# Altium schematic sheet GPIO.SchDoc
size A3; SheetNumber: 10; SheetTotal: 10
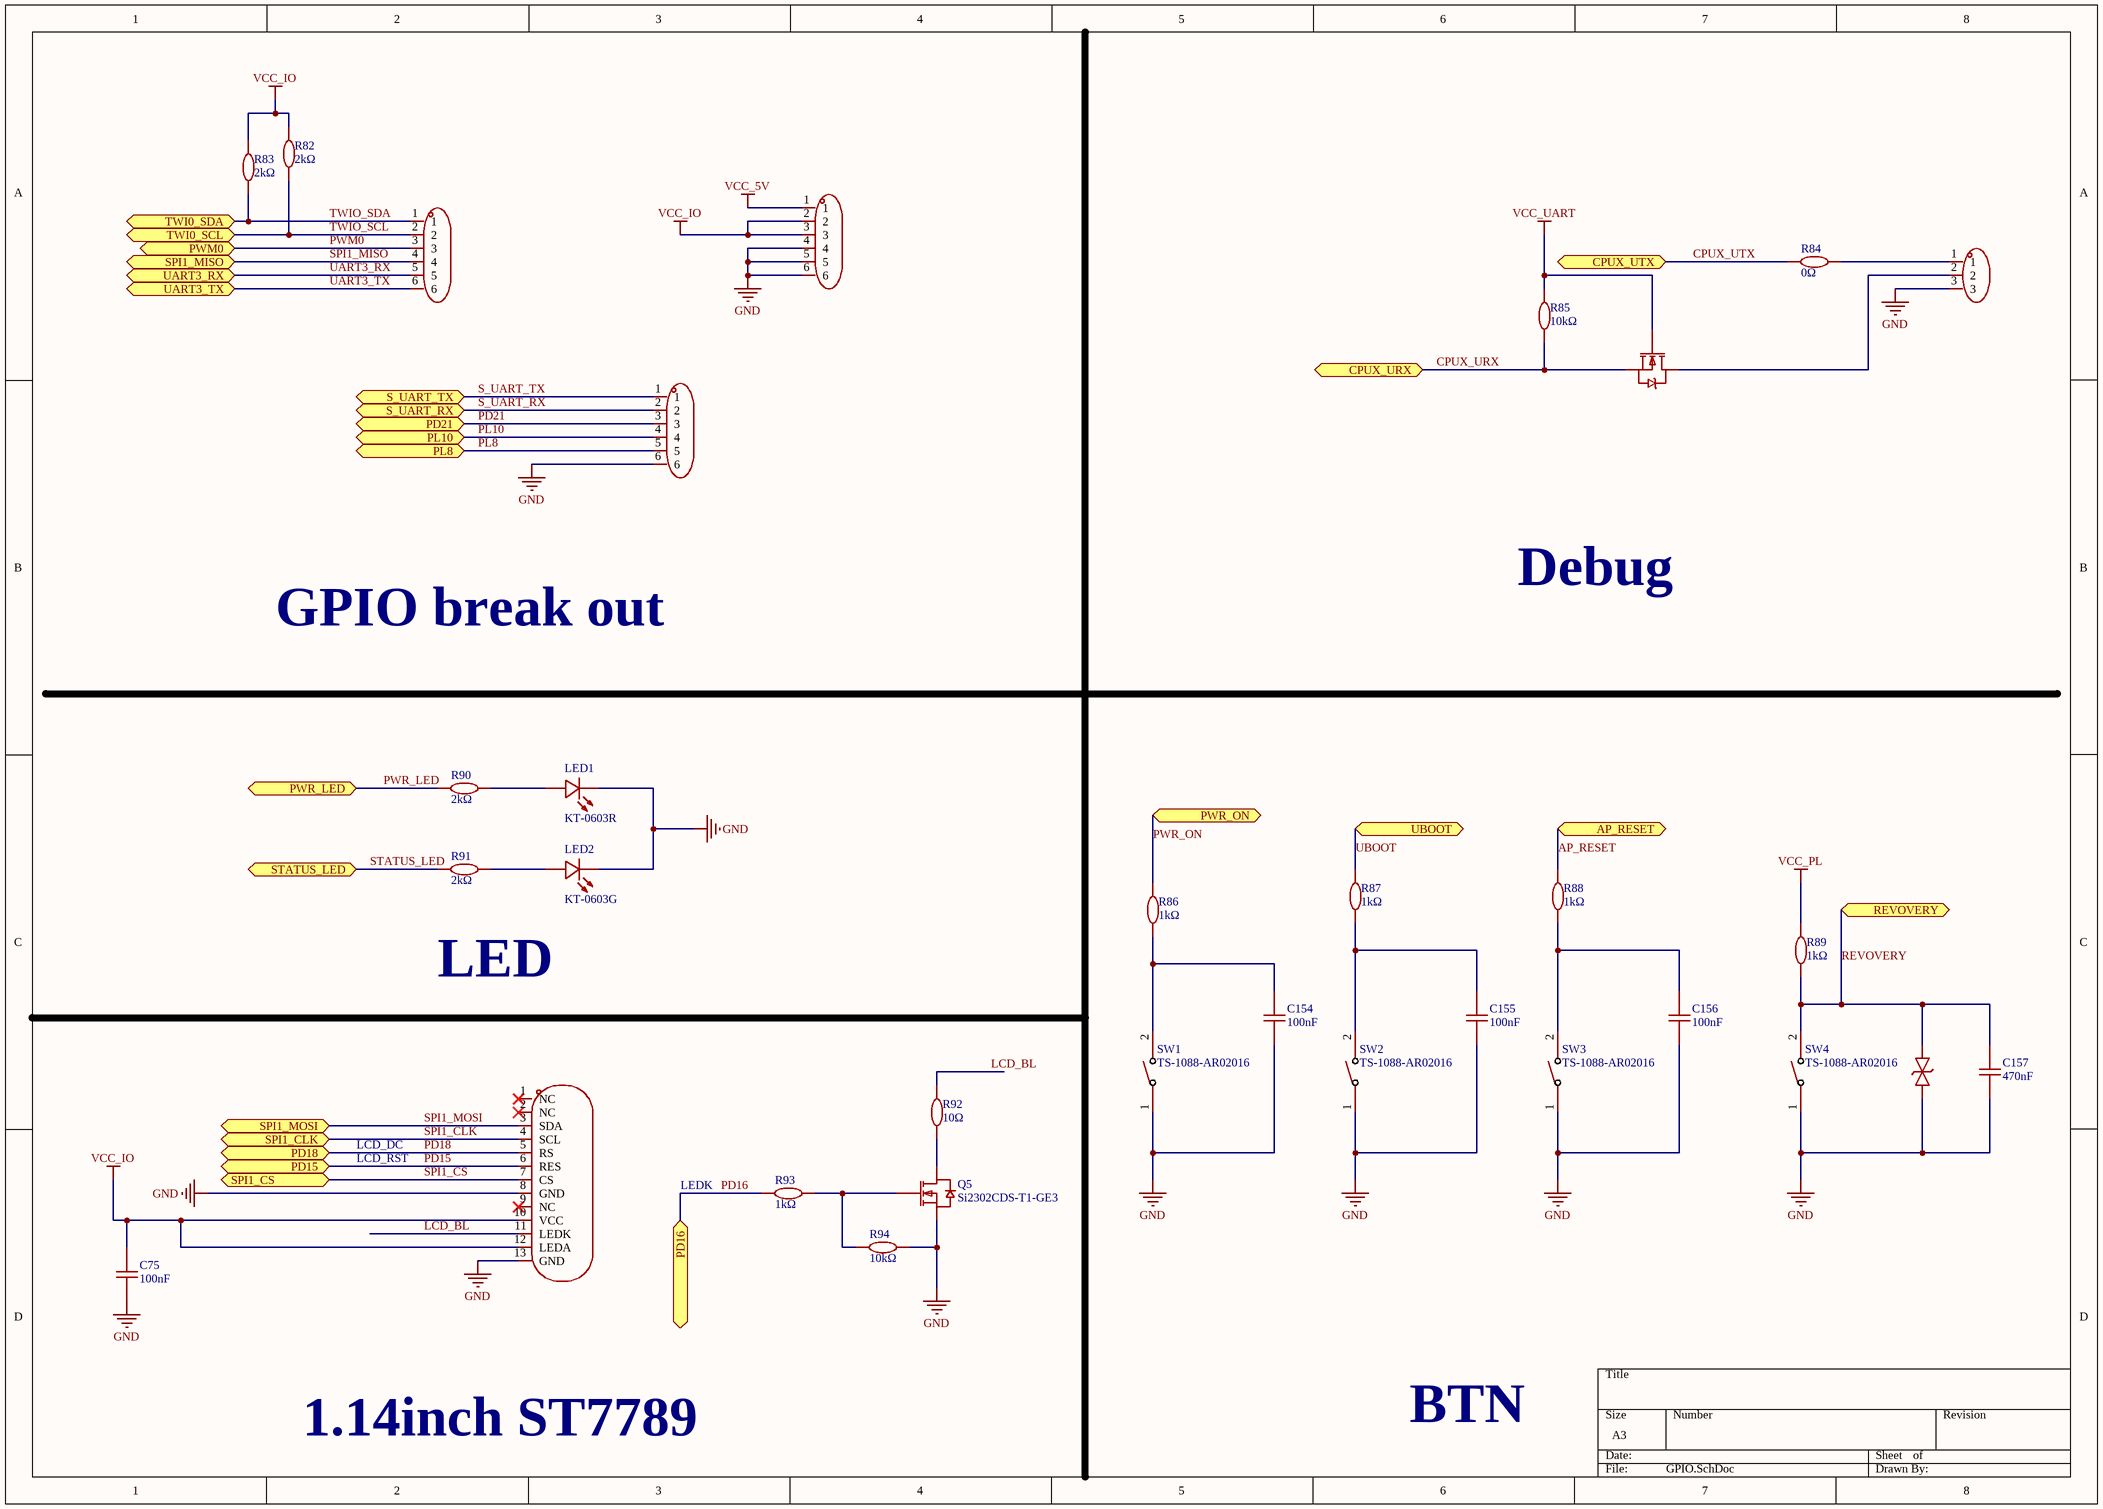
[diagram p0: GPIO.SchDoc]

## Parts
C75  100nF  [C0402]
C154  100nF  [C0402]
C155  100nF  [C0402]
C156  100nF  [C0402]
C157  470nF  [C0402]
H2  HX PZ2.54-1x3P ZZ  [CONN-TH_HX-PZ2.54-1X3P-ZZ]  (value not drawn)
LCD1  N099-0416THBIG01-H10  [LCD-SMD_10P-P0.70-L44.8-W8.6_N099-0416THBIG01-H10]  (value not drawn)
LED1  KT-0603R  [LED0603-RD]
LED2  KT-0603G  [LED0603-GR]
Q4  BSN20  [SOT-23-3_L2.9-W1.6-P1.90-LS2.8-BR]  (value not drawn)
Q5  Si2302CDS-T1-GE3  [SOT-23_L2.9-W1.3-P1.90-LS2.4-BR]
R82  2kΩ  [R0402]
R83  2kΩ  [R0402]
R84  0Ω  [R0402]
R85  10kΩ  [R0402]
R86  1kΩ  [R0402]
R87  1kΩ  [R0402]
R88  1kΩ  [R0402]
R89  1kΩ  [R0402]
R90  2kΩ  [R0402]
R91  2kΩ  [R0402]
R92  10Ω  [R0402]
R93  1kΩ  [R0402]
R94  10kΩ  [R0402]
SW1  TS-1088-AR02016  [SW-SMD_L3.9-W3.0-P4.45]
SW2  TS-1088-AR02016  [SW-SMD_L3.9-W3.0-P4.45]
SW3  TS-1088-AR02016  [SW-SMD_L3.9-W3.0-P4.45]
SW4  TS-1088-AR02016  [SW-SMD_L3.9-W3.0-P4.45]
U12  HX PZ2.54-1x6P ZZ  [HDR-TH_6P-P2.54-V-M]  (value not drawn)
U33  HX PZ2.54-1x6P ZZ  [HDR-TH_6P-P2.54-V-M]  (value not drawn)
U34  HX PZ2.54-1x6P ZZ  [HDR-TH_6P-P2.54-V-M]  (value not drawn)
U35  ESD5451N  [DFN1006-2L-BI]  (value not drawn)

## Ports
AP_RESET (bidir, see Power[4B], SoC_2[4A]), CPUX_URX (bidir, see SoC_1[6B]), CPUX_UTX (bidir, see SoC_1[6B]), PD15 (bidir, see SoC_1[2B]), PD16 (bidir, see SoC_1[2C]), PD18 (bidir, see SoC_1[2C]), PD21 (bidir, see SoC_1[2C]), PL8 (bidir, see SoC_1[6C]), PL10 (bidir, see SoC_1[6C]), PWM0 (bidir, see SoC_1[2C]), PWR_LED (bidir, see SoC_1[6C]), PWR_ON (bidir, see Power[4B]), REVOVERY (bidir, see SoC_1[6C]), S_UART_RX (bidir, see SoC_1[6C]), S_UART_TX (bidir, see SoC_1[6C]), SPI1_CLK (bidir, see SoC_1[6B]), SPI1_CS (bidir, see SoC_1[6B]), SPI1_MISO (bidir, see SoC_1[6B]), SPI1_MOSI (bidir, see SoC_1[6B]), STATUS_LED (bidir, see SoC_1[6C]), TWI0_SCL (bidir, see SoC_1[2C]), TWI0_SDA (bidir, see SoC_1[2C]), UART3_RX (bidir, see SoC_1[2C]), UART3_TX (bidir, see SoC_1[2C]), UBOOT (bidir, see SoC_2[4A])

## Nets
GND: C75.1 C154.1 C155.1 C156.1 C157.1 H2.3 LCD1.8(GND) LCD1.13(GND) LED1.1(K) LED2.1(K) Q5.2(S) R94.2 SW1.1 SW2.1 SW3.1 SW4.1 U12.4 U12.5 U12.6 U34.6 U35.1
VCC_5V: U12.1
VCC_IO: C75.2 LCD1.10(VCC) LCD1.12(LEDA) R82.2 R83.2 U12.2 U12.3
VCC_PL: R89.2
VCC_UART: Q4.1(G) R85.2
AP_RESET: R88.2 ; port AP_RESET
CPUX_URX: Q4.2(S) R85.1 ; port CPUX_URX
CPUX_UTX: R84.1 ; port CPUX_UTX
LCD_BL: LCD1.11(LEDK) R92.2
PD15: LCD1.6(RES) ; port PD15
PD16: R93.2 ; port PD16
PD18: LCD1.5(RS) ; port PD18
PD21: U34.3 ; port PD21
PL8: U34.5 ; port PL8
PL10: U34.4 ; port PL10
PWM0: U33.3 ; port PWM0
PWR_LED: R90.1 ; port PWR_LED
PWR_ON: R86.2 ; port PWR_ON
REVOVERY: C157.2 R89.1 SW4.2 U35.2 ; port REVOVERY
S_UART_RX: U34.2 ; port S_UART_RX
S_UART_TX: U34.1 ; port S_UART_TX
SPI1_CLK: LCD1.4(SCL) ; port SPI1_CLK
SPI1_CS: LCD1.7(CS) ; port SPI1_CS
SPI1_MISO: U33.4 ; port SPI1_MISO
SPI1_MOSI: LCD1.3(SDA) ; port SPI1_MOSI
STATUS_LED: R91.1 ; port STATUS_LED
TWIO_SCL: R82.1 U33.2 ; port TWI0_SCL
TWIO_SDA: R83.1 U33.1 ; port TWI0_SDA
UART3_RX: U33.5 ; port UART3_RX
UART3_TX: U33.6 ; port UART3_TX
UBOOT: R87.2 ; port UBOOT
NetC154_2: C154.2 R86.1 SW1.2
NetC155_2: C155.2 R87.1 SW2.2
NetC156_2: C156.2 R88.1 SW3.2
NetH2_1: H2.1 R84.2
NetH2_2: H2.2 Q4.3(D)
NetLED1_2: LED1.2(A) R90.2
NetLED2_2: LED2.2(A) R91.2
NetQ5_1: Q5.1(G) R93.1 R94.1
NetQ5_3: Q5.3(D) R92.1

Not connected (* = marked no-connect by the designer): LCD1 1(NC)* 2(NC)* 9(NC)*

## Notes on the sheet
- GPIO break out
- Debug
- LED
- LCD_DC
- LCD_RST
- LEDK
- 1.14inch ST7789
- BTN

## Library data of the parts
C75 C154-C156 = 100nF: 50V 100nF X7R ±10% 0402 Ceramic Capacitors ROHS
C157 = 470nF: 25V 470nF X5R ±10% 0402 Ceramic Capacitors ROHS
H2 = HX PZ2.54-1x3P ZZ: Manufacturer: hanxia(韩下); Add into BOM: yes; Pin Structure: 1x3P; Pitch: 2.54mm; Circluar Pins/Square Pins: Pin Header; Current Rating: 3A; Voltage Rating (Max): 1kV; Symbol: HX PZ2.54-1X3P ZZ; Device: HX PZ2.54-1x3P ZZ; LCSC Part Name: 1x3P 间距:2.54mm 方针 直插; Supplier Part: C32713269; Manufacturer Part: HX PZ2.54-1x3P ZZ; Supplier Footprint: 插件,P=2.54mm; JLCPCB Part Class: Extended Part; Datasheet: https://item.szlcsc.com/datasheet/HX%2520PZ2.54-1x3P%2520ZZ/34444549.html; Supplier: LCSC; Convert to PCB: yes; Row Spacing: -; Mounting Type: Through Hole; Number of Rows: 1; Number of Pins: 3P; Length of Mating Pin: 6mm; Insulation Height: 2.5mm; Length of End Connection Pin: 3mm; Contact Material: Brass; Contact Plating: Gold; Operating Temperature: -40℃~+105℃; Color: Black; Supplementary Features: -
LCD1 = N099-0416THBIG01-H10: 1.14inch ST7789 135x240 2 LCD, OLED, Graphic ROHS; Manufacturer: Wisevision(新智景); Add into BOM: yes; Dot Pixels: 160x40; Symbol: N099-0416THBIG01-H10; Device: N099-0416THBIG01-H10; LCSC Part Name: 0.99寸 彩色 40x160像素分辨率 焊接10PIN; Supplier Part: C5123574; Manufacturer Part: N099-0416THBIG01-H10; Supplier Footprint: -; JLCPCB Part Class: Extended Part; Datasheet: https://item.szlcsc.com/datasheet/N099-0416THBIG01-H10/5717767.html; Supplier: LCSC; Convert to PCB: yes; Size: 0.99
LED1 = KT-0603R: 25mA 1.8V~2.4V Red 0603 LED Indication - Discrete ROHS
LED2 = KT-0603G: Green 0603 LED Indication - Discrete ROHS
Q4 = BSN20_C116157: 50V 100mA 10Ω@2.75V,0.2A 1.5V@250uA 1 N-Channel SOT-23 Single FETs, MOSFETs ROHS; Manufacturer: SHIKUES(时科); Add into BOM: yes; Number: 1个N沟道; Input Capacitance(Ciss): 40pF; Reverse Transfer Capacitance (Crss@Vds): 10pF; Type: N沟道; Output Capacitance(Coss): 15pF; Symbol: BSN20; Device: BSN20_C116157; LCSC Part Name: 1个N沟道 耐压:50V 电流:0.1A; Supplier Part: C116157; Manufacturer Part: BSN20; Supplier Footprint: SOT-23; JLCPCB Part Class: Extended Part; Datasheet: https://item.szlcsc.com/datasheet/BSN20/117410.html; Supplier: LCSC; Convert to PCB: yes; Drain to Source Voltage: 50V; Current - Continuous Drain(Id): 100mA; RDS(on): 10Ω@2.75V,0.2A; Pd - Power Dissipation: -; Gate Threshold Voltage (Vgs(th)): 1.5V@250uA
R82 R83 R90 R91 = 2kΩ: 100mW 2kΩ 75V ±100ppm/℃ Thick Film Resistor ±1% 0402 Chip Resistor - Surface Mount ROHS
R84 = 0Ω: 0Ω 62.5mW 50V Thick Film Resistor ±1% 0402 Chip Resistor - Surface Mount ROHS
R85 R94 = 10kΩ: 62.5mW 10kΩ 50V ±100ppm/℃ Thick Film Resistor ±1% 0402 Chip Resistor - Surface Mount ROHS
R86-R89 R93 = 1kΩ: 1kΩ 62.5mW 50V ±100ppm/℃ Thick Film Resistor ±1% 0402 Chip Resistor - Surface Mount ROHS
R92 = 10Ω: 10Ω 62.5mW 50V ±200ppm/℃ Thick Film Resistor ±1% 0402 Chip Resistor - Surface Mount ROHS
SW1-SW4 = TS-1088-AR02016: Without Bracket 4mm 12V 3mm Round Button SPST 50mA SMD,4x3mm Tactile Switches ROHS
U12 U33 U34 = HX PZ2.54-1x6P ZZ: 6P 1x6P Gold Brass -40℃~+105℃ Black Pin Header 2.54mm 2.5mm 6mm 1kV 3mm 3A 1 Through Hole Through Hole,P=2.54mm Headers, Male Pins ROHS; Manufacturer: hanxia(韩下); Add into BOM: yes; Symbol: HX PZ2.54-1X6P ZZ; Device: HX PZ2.54-1x6P ZZ; LCSC Part Name: 1x6P 间距:2.54mm 方针 直插; Supplier Part: C32713272; Manufacturer Part: HX PZ2.54-1x6P ZZ; Supplier Footprint: 插件,P=2.54mm; JLCPCB Part Class: Extended Part; Datasheet: https://item.szlcsc.com/datasheet/HX%2520PZ2.54-1x6P%2520ZZ/34444552.html; Supplier: LCSC; Convert to PCB: yes; Pin Structure: 1x6P; Pitch: 2.54mm; Row Spacing: -; Circluar Pins/Square Pins: Pin Header; Mounting Type: Through Hole; Number of Rows: 1; Number of Pins: 6P; Current Rating: 3A; Voltage Rating (Max): 1kV; Length of Mating Pin: 6mm; Insulation Height: 2.5mm; Length of End Connection Pin: 3mm; Contact Material: Brass; Contact Plating: Gold; Operating Temperature: -40℃~+105℃; Color: Black; Supplementary Features: -
U35 = ESD5451N_C5261080: 9A 9.8V 8V Bidirectional 5V DFN1006-2L TVS Diodes ROHS; Manufacturer: HXY MOSFET(华轩阳电子); Add into BOM: yes; Reverse Leakage Current (Ir): 500nA; Number of Channels: 1.0; level of protection: IEC 61000-4-2; Junction Capacitance: 15pF; Symbol: ESD5451N_C5261080; Device: ESD5451N_C5261080; LCSC Part Name: 5V 15pF 双向; Supplier Part: C5261080; Manufacturer Part: ESD5451N; Supplier Footprint: DFN1006-2L; JLCPCB Part Class: Extended Part; Datasheet: https://item.szlcsc.com/datasheet/ESD5451N/5983779.html; Supplier: LCSC; Convert to PCB: yes; Polarity: Bidirectional; Reverse Stand-Off Voltage (Vrwm): 5V; Clamping Voltage: 9.8V; Peak Pulse Current (Ipp): 9A; Voltage - Breakdown: 8V; Type: ESD